# Altium schematic sheet iA-Pmod-AES3-4x4_Overview.SchDoc
size A4; CompanyName: imaginary Audio; Organization: imaginary Audio; Address1: 6903 101 Ave NW; Address2: Edmonton; Address3: AB; Address4: T6A 0H6; DocumentNumber: 1; Revision: 0.1; SheetNumber: 1; SheetTotal: 4; Designer: Gabriel Bessette; DocRev: 0.1
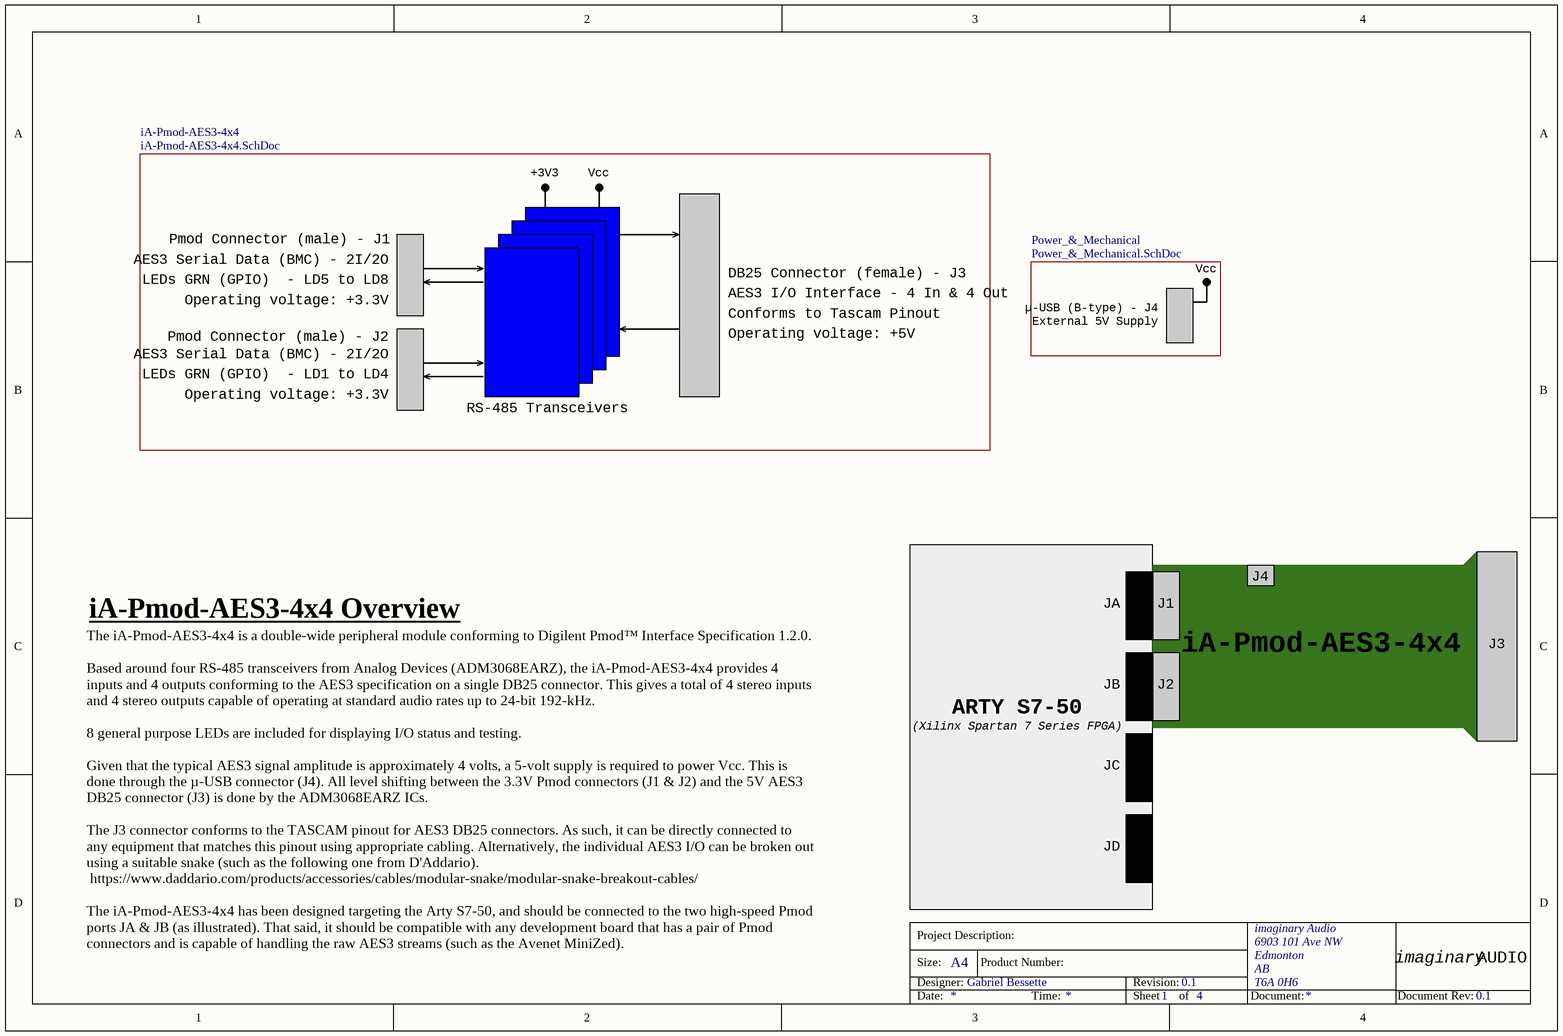
[diagram p0: iA-Pmod-AES3-4x4_Overview.SchDoc]

## Sub-sheets
iA-Pmod-AES3-4x4 = iA-Pmod-AES3-4x4.SchDoc: no entries
Power_&_Mechanical = Power_&_Mechanical.SchDoc: no entries

## Notes on the sheet
- +3V3
- Vcc
- Pmod Connector (male) - J1
- AES3 Serial Data (BMC) - 2I/2O
- Operating voltage: +3.3V
- LEDs GRN (GPIO)  - LD5 to LD8
- DB25 Connector (female) - J3
- AES3 I/O Interface - 4 In & 4 Out
- µ-USB (B-type) - J4
- Pmod Connector (male) - J2
- LEDs GRN (GPIO)  - LD1 to LD4
- Conforms to Tascam Pinout
- Operating voltage: +5V
- External 5V Supply
- RS-485 Transceivers
- J4
- iA-Pmod-AES3-4x4 Overview
- JA
- J1
- iA-Pmod-AES3-4x4
- J3
- ARTY S7-50
- JB
- J2
- (Xilinx Spartan 7 Series FPGA)
- JC
- JD
- The iA-Pmod-AES3-4x4 is a double-wide peripheral module conforming to Digilent Pmod™ Interface Specification 1.2.0.
  Based around four RS-485 transceivers from Analog Devices (ADM3068EARZ), the iA-Pmod-AES3-4x4 provides 4 inputs and 4 outputs conforming to the AES3 specification on a single DB25 connector. This gives a total of 4 stereo inputs and 4 stereo outputs capable of operating at standard audio rates up to 24-bit 192-kHz.
  8 general purpose LEDs are included for displaying I/O status and testing.
  Given that the typical AES3 signal amplitude is approximately 4 volts, a 5-volt supply is required to power Vcc. This is done through the µ-USB connector (J4). All level shifting between the 3.3V Pmod connectors (J1 & J2) and the 5V AES3 DB25 connector (J3) is done by the ADM3068EARZ ICs.
  The J3 connector conforms to the TASCAM pinout for AES3 DB25 connectors. As such, it can be directly connected to any equipment that matches this pinout using appropriate cabling. Alternatively, the individual AES3 I/O can be broken out using a suitable snake (such as the following one from D'Addario).
  https://www.daddario.com/products/accessories/cables/modular-snake/modular-snake-breakout-cables/
  The iA-Pmod-AES3-4x4 has been designed targeting the Arty S7-50, and should be connected to the two high-speed Pmod ports JA & JB (as illustrated). That said, it should be compatible with any development board that has a pair of Pmod connectors and is capable of handling the raw AES3 streams (such as the Avenet MiniZed).
- Project Description:
- Size:
- Designer:
- A4
- Product Number:
- Revision:
- imaginary
- AUDIO
- Date:
- Time:
- Sheet
- of
- Document:
- Document Rev: